# Altium schematic sheet slave_schematic.SchDoc: Pack Monitor
size A2; Author: Fivos Moutavelis; CompanyName: UP Karting; Revision: v1.0; SheetNumber: 1; SheetTotal: 2
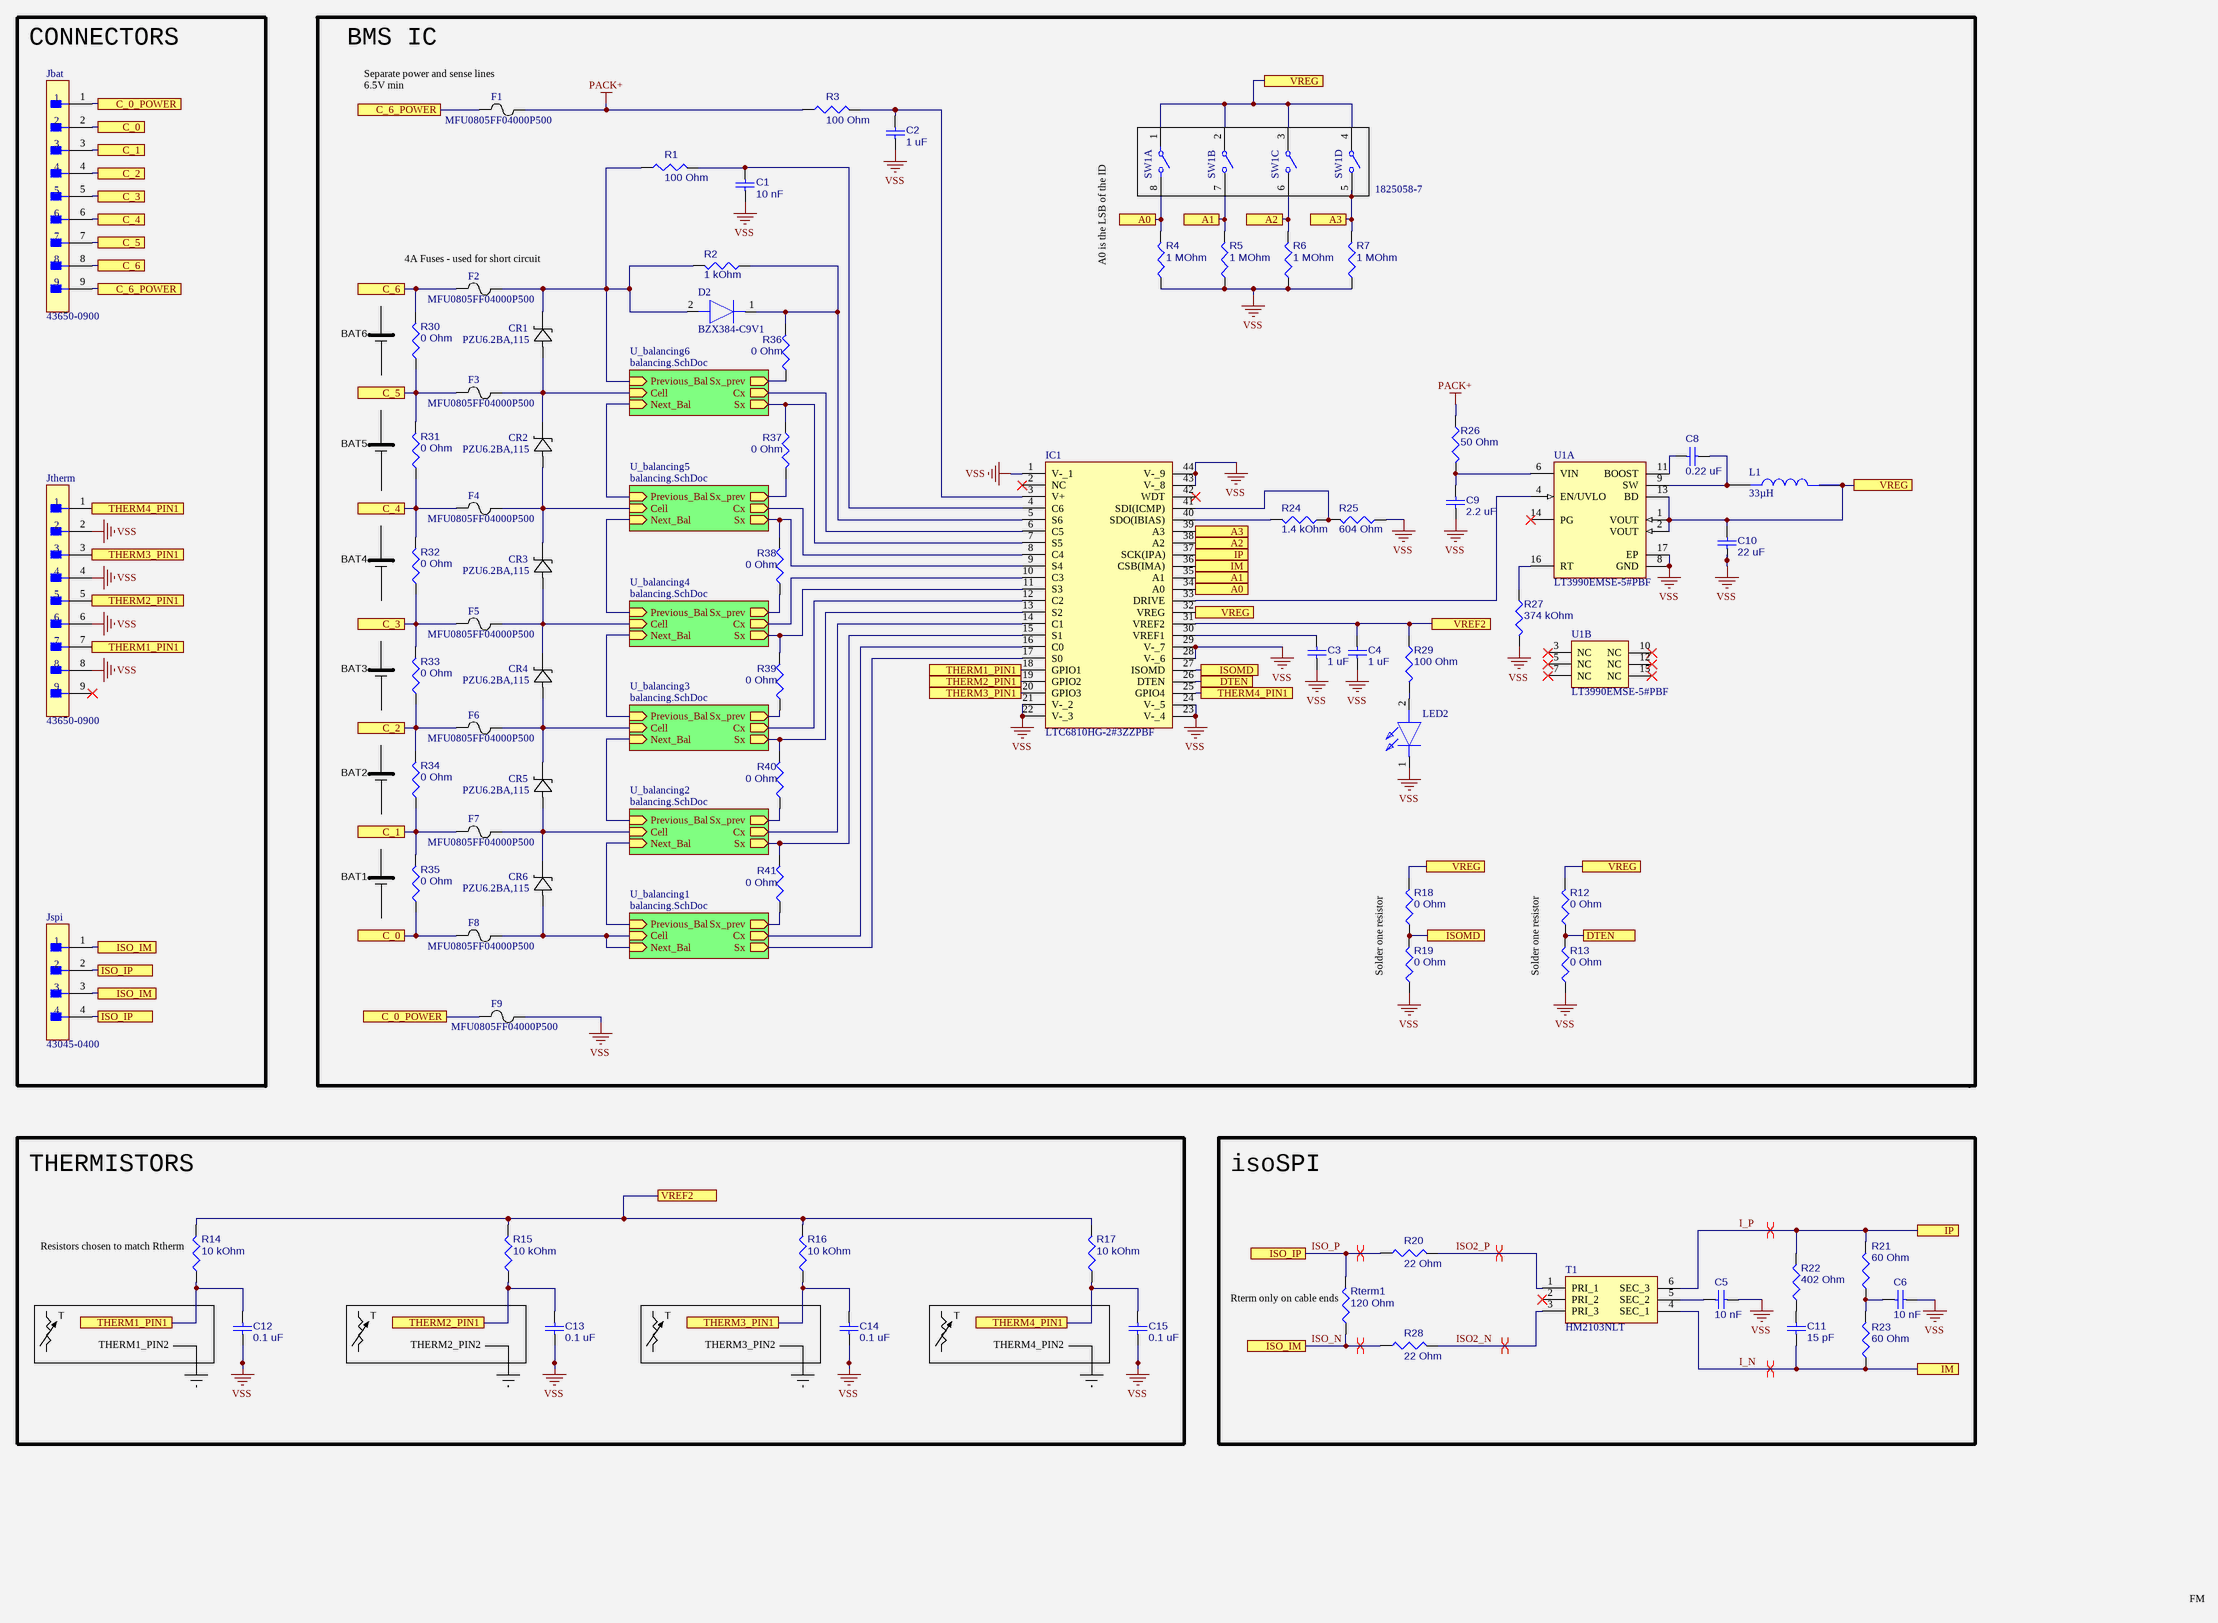
[diagram p0: slave_schematic.SchDoc]

## Parts
*  UP Karting logo 7x9  [New footprint 1]  (value not drawn)
C1  10 nF  [CAPC2012X14M]
C2  1 uF  [CAPC2012X14M]
C3  1 uF  [CAPC2012X14M]
C4  1 uF  [CAPC2012X14M]
C5  10 nF  [CAPC2012X14M]
C6  10 nF  [CAPC2012X14M]
C8  0.22 uF  [CAPC2012X14M]
C9  2.2 uF  [CAPC2012X14M]
C10  22 uF  [CAPC2012X14M]
C11  15 pF  [CAPC2012X14M]
C12  0.1 uF  [CAPC2012X14M]
C13  0.1 uF  [CAPC2012X14M]
C14  0.1 uF  [CAPC2012X14M]
C15  0.1 uF  [CAPC2012X14M]
CR1  PZU6.2BA,115  [CR_PZUxBA_NEX]
CR2  PZU6.2BA,115  [CR_PZUxBA_NEX]
CR3  PZU6.2BA,115  [CR_PZUxBA_NEX]
CR4  PZU6.2BA,115  [CR_PZUxBA_NEX]
CR5  PZU6.2BA,115  [CR_PZUxBA_NEX]
CR6  PZU6.2BA,115  [CR_PZUxBA_NEX]
D2  BZX384-C9V1  [SOD2512X110N]
F1  MFU0805FF04000P500  [FUS_VISHAY_MFU0805_VIS]
F2  MFU0805FF04000P500  [FUS_VISHAY_MFU0805_VIS]
F3  MFU0805FF04000P500  [FUS_VISHAY_MFU0805_VIS]
F4  MFU0805FF04000P500  [FUS_VISHAY_MFU0805_VIS]
F5  MFU0805FF04000P500  [FUS_VISHAY_MFU0805_VIS]
F6  MFU0805FF04000P500  [FUS_VISHAY_MFU0805_VIS]
F7  MFU0805FF04000P500  [FUS_VISHAY_MFU0805_VIS]
F8  MFU0805FF04000P500  [FUS_VISHAY_MFU0805_VIS]
F9  MFU0805FF04000P500  [FUS_VISHAY_MFU0805_VIS]
IC1  LTC6810HG-2#3ZZPBF  [SOP50P780X200-44N]
Jbat  43650-0900  [FP-43650-0900-MFG]
Jspi  43045-0400  [FP-43045-0400-MFG]
Jtherm  43650-0900  [FP-43650-0900-MFG]
L1  value 33µH  [IND_VLS5045EX-330M-H]  (hidden comment: VLS5045EX-330M-H)
LED2  LS_R976-NR-1  [LEDC2012X40N]  (value not drawn)
R1  100 Ohm  [RESC2012X06M]
R2  1 kOhm  [RESC2012X06M]
R3  100 Ohm  [RESC2012X06M]
R4  1 MOhm  [RESC2012X06M]
R5  1 MOhm  [RESC2012X06M]
R6  1 MOhm  [RESC2012X06M]
R7  1 MOhm  [RESC2012X06M]
R12  0 Ohm  [RESC2012X06M]
R13  0 Ohm  [RESC2012X06M]
R14  10 kOhm  [RESC2012X06M]
R15  10 kOhm  [RESC2012X06M]
R16  10 kOhm  [RESC2012X06M]
R17  10 kOhm  [RESC2012X06M]
R18  0 Ohm  [RESC2012X06M]
R19  0 Ohm  [RESC2012X06M]
R20  22 Ohm  [RESC2012X06M]
R21  60 Ohm  [RESC2012X06M]
R22  402 Ohm  [RESC2012X06M]
R23  60 Ohm  [RESC2012X06M]
R24  1.4 kOhm  [RESC2012X06M]
R25  604 Ohm  [RESC2012X06M]
R26  50 Ohm  [RESC2012X06M]
R27  374 kOhm  [RESC2012X06M]
R28  22 Ohm  [RESC2012X06M]
R29  100 Ohm  [RESC2012X06M]
R30  0 Ohm  [RESC2012X06M]
R31  0 Ohm  [RESC2012X06M]
R32  0 Ohm  [RESC2012X06M]
R33  0 Ohm  [RESC2012X06M]
R34  0 Ohm  [RESC2012X06M]
R35  0 Ohm  [RESC2012X06M]
R36  0 Ohm  [RESC2012X06M]
R37  0 Ohm  [RESC2012X06M]
R38  0 Ohm  [RESC2012X06M]
R39  0 Ohm  [RESC2012X06M]
R40  0 Ohm  [RESC2012X06M]
R41  0 Ohm  [RESC2012X06M]
Rterm1  120 Ohm  [RESC2012X06M]
SW1  1825058-7  [FP-1825058-7-MFG]  (value not drawn)  (parts A,B,C,D of 4)
T1  HM2103NLT  [SOP254P940X572-6N]
U1  LT3990EMSE-5#PBF  [LT-MSE-16-EDP_M]  (parts A,B of 2)

## Blocks framed on the sheet
CONNECTORS: Jbat Jspi Jtherm
BMS IC: C1-C4 C8-C10 CR1-CR6 D2 F1-F9 IC1 L1 LED2 R1-R7 R12 R13 R18 R19 R24-R27 R29-R41 SW1 U1
THERMISTORS: C12-C15 R14-R17
isoSPI: C5 C6 C11 R20-R23 R28 Rterm1 T1

## Sub-sheets
U_balancing1 = balancing.SchDoc: Cell (in), Cx (out), Previous_Bal (in), Sx (out), Next_Bal (in), Sx_prev (out)
U_balancing2 = balancing.SchDoc: Cell (in), Cx (out), Previous_Bal (in), Sx (out), Next_Bal (in), Sx_prev (out)
U_balancing3 = balancing.SchDoc: Cell (in), Cx (out), Previous_Bal (in), Sx (out), Next_Bal (in), Sx_prev (out)
U_balancing4 = balancing.SchDoc: Cell (in), Cx (out), Previous_Bal (in), Sx (out), Next_Bal (in), Sx_prev (out)
U_balancing5 = balancing.SchDoc: Cell (in), Cx (out), Previous_Bal (in), Sx (out), Next_Bal (in), Sx_prev (out)
U_balancing6 = balancing.SchDoc: Cell (in), Cx (out), Previous_Bal (in), Sx (out), Next_Bal (in), Sx_prev (out)

## Ports
A0, A1, A2, A3, C_0, C_0_POWER, C_1, C_2, C_3, C_4, C_5, C_6, C_6_POWER, DTEN, IM, IP, ISO_IM, ISO_IP, ISOMD, THERM1_PIN1, THERM2_PIN1, THERM3_PIN1, THERM4_PIN1, VREF2, VREG

## Nets
PACK+: F1.2 R3.1 R26.1
VSS: C1.2 C2.2 C3.2 C4.2 C5.2 C6.2 C9.2 C10.1 C12.2 C13.2 C14.2 C15.2 F9.2 IC1.1(V-_1) IC1.21(V-_2) IC1.22(V-_3) IC1.23(V-_4) IC1.24(V-_5) IC1.28(V-_6) IC1.29(V-_7) IC1.43(V-_8) IC1.44(V-_9) Jtherm.2 Jtherm.4 Jtherm.6 Jtherm.8 LED2.1(K) R4.1 R5.1 R6.1 R7.1 R13.1 R19.1 R25.1 R27.2 U1.8(GND) U1.17(EP)
A0: IC1.34(A0) R4.2 SW1.8 ; port A0
A1: IC1.35(A1) R5.2 SW1.7 ; port A1
A2: IC1.38(A2) R6.2 SW1.6 ; port A2
A3: IC1.39(A3) R7.2 SW1.5 ; port A3
C_0: F8.1 Jbat.2 R35.1 ; port C_0
C_0_POWER: F9.1 Jbat.1 ; port C_0_POWER
C_1: F7.1 Jbat.3 R34.1 R35.2 ; port C_1
C_2: F6.1 Jbat.4 R33.1 R34.2 ; port C_2
C_3: F5.1 Jbat.5 R32.1 R33.2 ; port C_3
C_4: F4.1 Jbat.6 R31.1 R32.2 ; port C_4
C_5: F3.1 Jbat.7 R30.1 R31.2 ; port C_5
C_6: F2.1 Jbat.8 R30.2 ; port C_6
C_6_POWER: F1.1 Jbat.9 ; port C_6_POWER
DTEN: IC1.26(DTEN) R12.1 R13.2 ; port DTEN
I_N: C11.1 IC1.36(CSB(IMA)) R23.1 T1.4(SEC_1) ; port IM
I_P: IC1.37(SCK(IPA)) R21.2 R22.2 T1.6(SEC_3) ; port IP
ISO2_N: R28.2 T1.3(PRI_3)
ISO2_P: R20.2 T1.1(PRI_1)
ISO_N: Jspi.1 Jspi.3 R28.1 Rterm1.1 ; port ISO_IM
ISO_P: Jspi.2 Jspi.4 R20.1 Rterm1.2 ; port ISO_IP
ISOMD: IC1.27(ISOMD) R18.1 R19.2 ; port ISOMD
THERM1_PIN1: C12.1 IC1.18(GPIO1) Jtherm.7 R14.1 ; port THERM1_PIN1
THERM2_PIN1: C13.1 IC1.19(GPIO2) Jtherm.5 R15.1 ; port THERM2_PIN1
THERM3_PIN1: C14.1 IC1.20(GPIO3) Jtherm.3 R16.1 ; port THERM3_PIN1
THERM4_PIN1: C15.1 IC1.25(GPIO4) Jtherm.1 R17.1 ; port THERM4_PIN1
VREF2: C4.1 IC1.31(VREF2) R14.2 R15.2 R16.2 R17.2 R29.1 ; port VREF2
VREG: C10.2 IC1.32(VREG) L1.2 R12.2 R18.2 SW1.1 SW1.2 SW1.3 SW1.4 U1.1(VOUT) U1.2(VOUT) U1.13(BD) ; port VREG
NetC1_1: C1.1 IC1.4(C6) R1.2
NetC2_1: C2.1 IC1.3(V+) R3.2
NetC3_1: C3.1 IC1.30(VREF1)
NetC5_1: C5.1 T1.5(SEC_2)
NetC6_1: C6.1 R21.1 R23.2
NetC8_1: C8.1 U1.11(BOOST)
NetC8_2: C8.2 L1.1 U1.9(SW)
NetC9_1: C9.1 R26.2 U1.6(VIN)
NetC11_2: C11.2 R22.1
NetCR1_1: CR1.1 D2.2(A) F2.2 R1.1 R2.2 ; sheet U_balancing6/Previous_Bal
NetCR1_2: CR1.2 CR2.1 F3.2 ; sheet U_balancing6/Cell
NetCR2_2: CR2.2 CR3.1 F4.2 ; sheet U_balancing5/Cell
NetCR3_2: CR3.2 CR4.1 F5.2 ; sheet U_balancing4/Cell
NetCR4_2: CR4.2 CR5.1 F6.2 ; sheet U_balancing3/Cell
NetCR5_2: CR5.2 CR6.1 F7.2 ; sheet U_balancing2/Cell
NetCR6_2: CR6.2 F8.2 ; sheet U_balancing1/Cell, sheet U_balancing1/Next_Bal
NetD2_1: D2.1(K) IC1.5(S6) R2.1 R36.2
NetIC1_6: IC1.6(C5) ; sheet U_balancing6/Cx
NetIC1_7: IC1.7(S5) R37.1 ; sheet U_balancing6/Sx
NetIC1_8: IC1.8(C4) ; sheet U_balancing5/Cx
NetIC1_9: IC1.9(S4) R38.2 ; sheet U_balancing5/Sx
NetIC1_10: IC1.10(C3) ; sheet U_balancing4/Cx
NetIC1_11: IC1.11(S3) R39.2 ; sheet U_balancing4/Sx
NetIC1_12: IC1.12(C2) ; sheet U_balancing3/Cx
NetIC1_13: IC1.13(S2) R40.2 ; sheet U_balancing3/Sx
NetIC1_14: IC1.14(C1) ; sheet U_balancing2/Cx
NetIC1_15: IC1.15(S1) R41.2 ; sheet U_balancing2/Sx
NetIC1_16: IC1.16(C0) ; sheet U_balancing1/Cx
NetIC1_17: IC1.17(S0) ; sheet U_balancing1/Sx
NetIC1_33: IC1.33(DRIVE) U1.4(EN/UVLO)
NetIC1_40: IC1.40(SDO(IBIAS)) R24.2
NetIC1_41: IC1.41(SDI(ICMP)) R24.1 R25.2
NetLED2_2: LED2.2(A) R29.2
NetR27_1: R27.1 U1.16(RT)
NetR36_1: R36.1 ; sheet U_balancing6/Sx_prev
NetR37_2: R37.2 ; sheet U_balancing5/Sx_prev
NetR38_1: R38.1 ; sheet U_balancing4/Sx_prev
NetR39_1: R39.1 ; sheet U_balancing3/Sx_prev
NetR40_1: R40.1 ; sheet U_balancing2/Sx_prev
NetR41_1: R41.1 ; sheet U_balancing1/Sx_prev
(unnamed): sheet U_balancing6/Next_Bal, sheet U_balancing5/Previous_Bal
(unnamed): sheet U_balancing5/Next_Bal, sheet U_balancing4/Previous_Bal
(unnamed): sheet U_balancing4/Next_Bal, sheet U_balancing3/Previous_Bal
(unnamed): sheet U_balancing3/Next_Bal, sheet U_balancing2/Previous_Bal
(unnamed): sheet U_balancing2/Next_Bal, sheet U_balancing1/Previous_Bal

Not connected (* = marked no-connect by the designer): IC1 2(NC)* 42(WDT)*; Jtherm 9*; T1 2(PRI_2)*; U1 3(NC)* 5(NC)* 7(NC)* 10(NC)* 12(NC)* 14(PG)* 15(NC)*

## Layout directives
differential pair: I_N, I_P, ISO2_N, ISO2_P, ISO_N, ISO_P

## Notes on the sheet
- 6.5V min
- (near F1) Separate power and sense lines
- (near F2) 4A Fuses - used for short circuit
- A0 is the LSB of the ID
- BAT6
- BAT5
- BAT4
- BAT3
- BAT2
- BAT1
- Solder one resistor
- (near R14) Resistors chosen to match Rtherm
- T
- (near Rterm1) Rterm only on cable ends
- THERM1_PIN2
- THERM2_PIN2
- THERM3_PIN2
- THERM4_PIN2
- FM

## Library data of the parts
* = CMP-00030-00006-1: UP Karting logo 7x9mm
C1-C6 C8-C15 = CMP-001-00083-4: 0805_generic_capacitor
CR1-CR6 = CMP-039-000000-2: No Description Available; Manufacturer_Name: Nexperia; Source: PZU6P2BA,115.SchLib; Manufacturer_Part_Number: PZU6.2BA,115; Pin Count: 2; Design Item ID: PZU6.2BA,115; Copyright: Copyright (C) 2026 Ultra Librarian. All rights reserved.; Component Type: Standard
D2 = BZX384-C9V1: Diode; Manufacturer_Name: Nexperia; Datasheet Link: https://datasheet.datasheetarchive.com/originals/distributors/Datasheets-301/11577.pdf; Height: 1.1mm; Manufacturer_Part_Number: BZX384-C9V1
F1-F9 = CMP-005-00014-2: MFU 0805-FF P5 4A0; Manufacturer_Name: Vishay; Manufacturer_Part_Number: MFU0805FF04000P500; Copyright: Copyright (C) 2026 Ultra Librarian. All rights reserved.; Design Item ID: MFU0805FF04000P500; Pins: 2; Source: MFU0805FF04000P500.SchLib; Component Type: Standard
IC1 = LTC6810HG-2#3ZZPBF: Integrated Circuit; Manufacturer_Name: Analog Devices; Datasheet Link: http://www.analog.com/media/en/technical-documentation/data-sheets/LTC6810-1-6810-2.pdf; Height: 2mm; Manufacturer_Part_Number: LTC6810HG-2#3ZZPBF; Mouser Part Number: 584-6810HG23ZZPBF; Mouser Price/Stock: https://www.mouser.co.uk/ProductDetail/Analog-Devices/LTC6810HG-23ZZPBF?qs=byeeYqUIh0Px%2F9hvtPa9Ew%3D%3D; Arrow Part Number: LTC6810HG-2#3ZZPBF; Arrow Price/Stock: https://www.arrow.com/en/products/ltc6810hg-23zzpbf/analog-devices?region=nac
Jbat Jtherm = CMP-00257-00277484-1: 43650-0900 Conn Power HDR 9 POS 3mm Solder RA Thru-Hole 9 Terminal 1 Port Micro-Fit 3.0™ Frame; Manufacturer Lifecycle Status: ACTIVE; NexarPartId: 277484; Voltage Rating: 600V; Connector Type: Male Pin; Gender: Male; Current Rating: 5A; Number of Positions: 9; Glow Wire Compliant: Compliant; Plating: Tin; Voltage Rating (DC): 250V; Halogen Free: Low Halogen; Housing Material: Thermoplastic; Contact Plating: Tin; Termination: Solder; Lifecycle Status: Production; Contact Material: Brass; Fastening Type: Ramp; Country of Origin: US; Housing Color: Black; Min Operating Temperature: -40°C; Max Operating Temperature: 105°C; RoHS: Compliant; Pitch: 3mm; Lead Pitch: 3mm; Number of Contacts: 9; Mount: Through Hole; Orientation: Right Angle, Vertical; Number of Rows: 1; Number of Circuits: 9; Schedule B: 8536695050; Color: Black
Jspi = CMP-04776-000002-1: CONN HEADER R/A 4POS 3MM; Manufacturer: Molex; Conn Gender: Male; Conn Orientation: Right Angle; Voltage Rating: 600V; Number Of Contacts: 4; Is Female: yes; Current Rating: 8.5A; ComponentLink2URL: https://www.molex.com/webdocs/datasheets/pdf/en-us/0430450400_PCB_HEADERS.pdf; Manufacturer Part Number: 43045-0400; Digikey Description: CONN HEADER R/A 4POS 3MM; Category: Conn; Temperature Range High: +105°C; Lead Free: Yes; Device Class L1: Connectors; Automotive: No; Temperature: -40°C to +105°C; Footprint Url: https://www.molex.com/pdm_docs/sd/430450400_sd.pdf; Height: 9.27mm; Number Of Rows: 2; Device Class L3: unset; Pitch: 3mm; Temperature Range Low: -40°C; Contact Material: Tin,Nickel; Octopart: https://octopart.com/43045-0400-molex-287063; RoHS: TRUE; ComponentLink2Description: Datasheet; Package: 43045-0400; Device Class L2: Headers and Wire Housings
L1 = CMP-006-00021-1: Inductor Power Shielded Wirewound 33uH 20% 100KHz Ferrite 1.3A 0.312Ohm DCR Automotive T/R; MF: TDK Corporation; Source: VLS5045EX-330M-H.SchLib; Check_prices: https://www.snapeda.com/parts/VLS5045EX-330M-H/TDK/view-part/?ref=eda; SnapEDA_Link: https://www.snapeda.com/parts/VLS5045EX-330M-H/TDK/view-part/?ref=snap; Case/Package: NON STANDARD-2 TDK; MP: VLS5045EX-330M-H; Pins: 2; Price: None; Design Item ID: VLS5045EX-330M-H; Purchase-URL: https://pricing.snapeda.com/search/part/VLS5045EX-330M-H/?ref=eda; Availability: In Stock; Component Type: Standard
LED2 = LS_R976-NR-1: LED; Manufacturer_Name: ams OSRAM; Manufacturer_Part_Number: LS R976-NR-1; Datasheet Link: https://datasheet.datasheetarchive.com/originals/distributors/DKDS-18/344792.pdf; Height: 0.4mm; Mouser Part Number: 720-LSR976-NR-1; Mouser Price/Stock: https://www.mouser.co.uk/ProductDetail/ams-OSRAM/LS-R976-NR-1?qs=K5ta8V%252BWhtZhvCAe1sTZFg%3D%3D; Arrow Part Number: LS R976-NR-1; Arrow Price/Stock: https://www.arrow.com/en/products/lsr976-nr-1/osram-opto-semiconductors
R1-R7 R12-R41 Rterm1 = CMP-009-00178-2: 805_generic_resistor
SW1 = CMP-03400-000038-1: SWITCH SLIDE DIP SPST 100MA 24V; Pitch: 0.1inch; Number of Positions: 4; Voltage Rating (DC): 5V; Contact Current Rating: 1A; Sealable: No (Without); Housing Material: Polyphenylene; Depth: 9.29mm; Max Voltage Rating (DC): 24V; Contact Plating: Gold; Mount: Surface Mount; Package Quantity: 35; Number of Circuits: 4; Min Operating Temperature: -30°C; Actuator Type: SLIDE; Housing Color: Black; ELV: Compliant; Radiation Hardening: No; Max Current Rating: 100mA; REACH SVHC: No SVHC; Packaging: Rail/Tube; Throw Configuration: SPST; Flammability Rating: UL94 V-0; RoHS Compliant: Yes; Type: Switch; Height: 0.138inch; Orientation: Straight; Termination: Gull Wing; Contact Material: Copper Alloy; Length: 12.14mm; Max Operating Temperature: 85°C
T1 = HM2103NLT: Transformer; Manufacturer_Name: Yageo Group; Datasheet Link: https://productfinder.pulseeng.com/doc_type/WEB301/doc_num/HM2103NL/doc_part/HM2103NL.pdf; Height: 5.72mm; Manufacturer_Part_Number: HM2103NLT; Mouser Part Number: 673-HM2103NLT; Mouser Price/Stock: https://www.mouser.co.uk/ProductDetail/Pulse-Electronics/HM2103NLT?qs=lYGu3FyN48djzHw7Qak0wA%3D%3D; Arrow Part Number: HM2103NLT; Arrow Price/Stock: null?region=nac
U1 = CMP-0491-01162-1: 350 mA Step-Down Regulator with 2.5 uA Quiescent Current and Integrated Diodes, 16-pin SOP (MSE-16-EDP), -40 to 125 degC, Pb-Free; Manufacturer: Linear Technology; Frequency Adjust Range: 200kHz - 2.2MHz; Number of Outputs: 1; PackageDescription: 16-Pin Plastic MSOP, Exposed Die Pad, Body 4.039 x 3 mm, Pitch 0.5 mm; DatasheetVersion: Rev. B; PackageReference: MSE-16; ComponentLink1URL: http://www.linear.com/; PackageVersion: Rev. F, 05/2013; ComponentLink3URL: http://cds.linear.com/docs/en/packaging/05081667_F_MSE16.pdf; ComponentLink2URL: http://cds.linear.com/docs/en/datasheet/3990fa.pdf; RoHS: TRUE; PartNumber: LT3990EMSE-5#PBF; ComponentLink3Description: Package Specification; ComponentLink2Description: Datasheet; ComponentLink1Description: Manufacturer URL; Mounting Technology: Surface Mount